# Altium project AGR_SensorHUB.PrjPcb
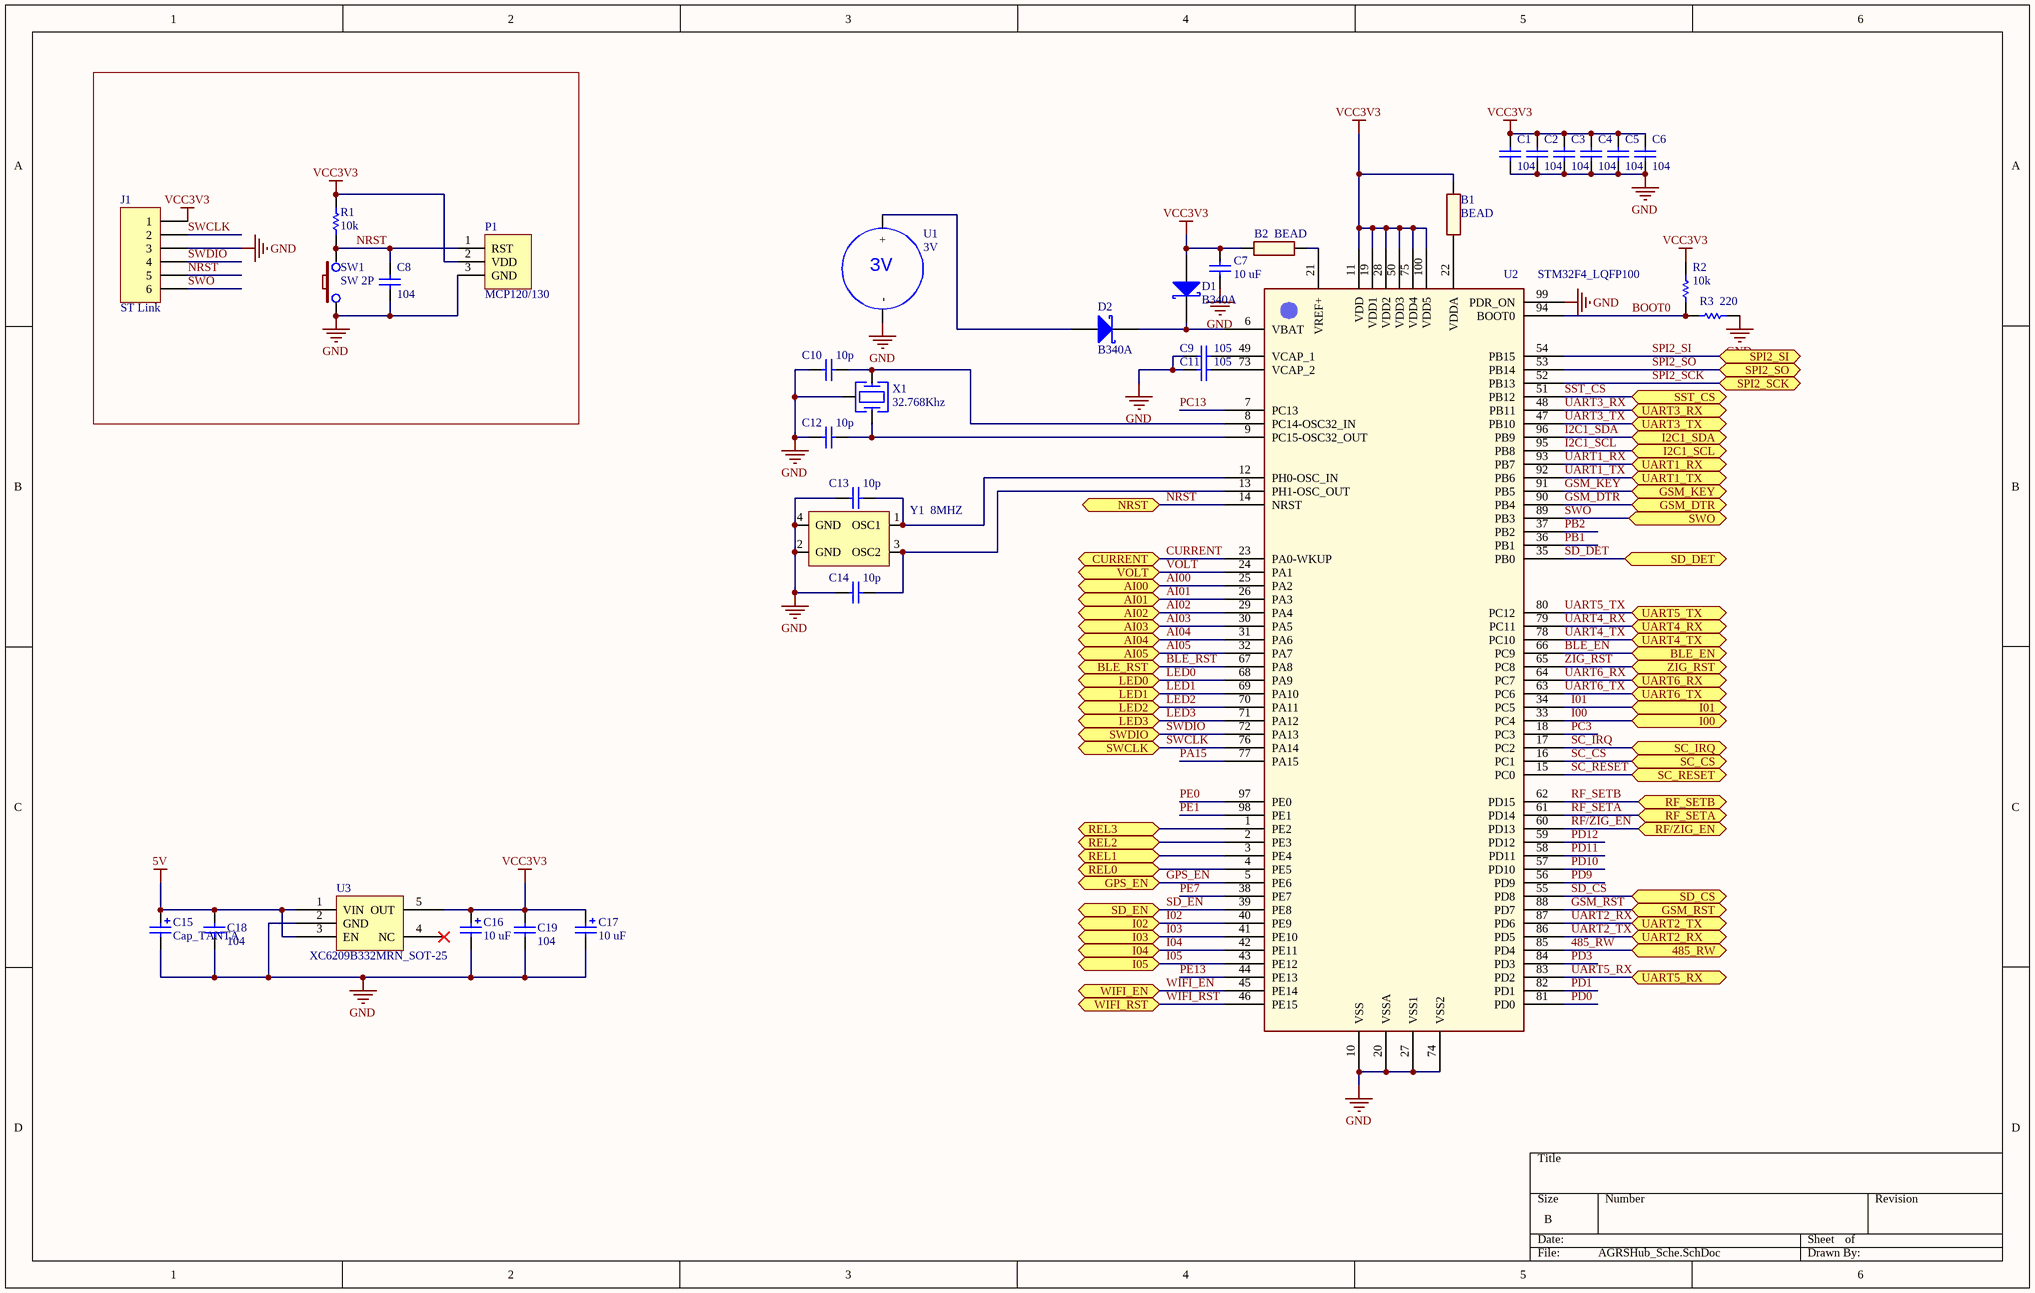
[diagram p0: AGRSHub_Sche.SchDoc]
14 sheets, 159 parts. Net scope: flat (ports and power ports of the same name join across sheets).
Board file: AGRSHUB_PCB.PcbDoc
Sheets:
  AGRSHub_Sche.SchDoc
  GSM.SchDoc
  GPS.SchDoc
  WIFI.SchDoc
  RSxx.SchDoc
  BLE.SchDoc
  DEBUG.SchDoc
  RF.SchDoc
  RELAY.SchDoc
  MEMORY.SchDoc
  INPUT.SchDoc
  DISPLAY.SchDoc
  POWER.SchDoc
  HOLE.SchDoc

## Sheet AGRSHub_Sche.SchDoc
size B

### Parts
B1  BEAD  [0805_M]
B2  BEAD  [0805_M]
C1  104  [C0603]
C2  104  [C0603]
C3  104  [C0603]
C4  104  [C0603]
C5  104  [C0603]
C6  104  [C0603]
C7  10 uF  [C0603]
C8  104  [C0603]
C9  105  [C0603]
C10  10p  [C0603]
C11  105  [C0603]
C12  10p  [C0603]
C13  10p  [C0603]
C14  10p  [C0603]
C15  Cap_TANTA  [CAP_TANTA_SMD_10UF/10V/16V]
C16  10 uF  [CAP_TANTA_SMD_10UF/10V/16V]
C17  10 uF  [CAP_TANTA_SMD_10UF/10V/16V]
C18  104  [C0603]
C19  104  [C0603]
D1  B340A  [DO_213AA]
D2  B340A  [DO_213AA]
J1  ST Link  [HEADER 6]
P1  MCP120/130  [SOT23-3]
R1  10k  [R0603]
R2  10k  [R0603]
R3  220  [R0603]
SW1  SW 2P  [SW TACT]
U1  3V  [BAT CR1220 Holder]
U2  STM32F4_LQFP100  [TSQFP50P1600X1600X160-100N]
U3  XC6209B332MRN_SOT-25  [SOT23-5]
X1  value 32.768Khz  [Crystal cylinder]  (hidden comment: Crystal1)
Y1  8MHZ  [CRYSTAL 5032]

### Ports
485_RW, AI00, AI01, AI02, AI03, AI04, AI05, BLE_EN, BLE_RST, CURRENT, GPS_EN, GSM_DTR, GSM_KEY, GSM_RST, I00, I01, I02, I2C1_SCL, I2C1_SDA, I03, I04, I05, LED0, LED1, LED2, LED3, NRST, REL0, REL1, REL2, REL3, RF/ZIG_EN, RF_SETA, RF_SETB, SC_CS, SC_IRQ, SC_RESET, SD_CS, SD_DET, SD_EN, SPI2_SCK, SPI2_SI, SPI2_SO, SST_CS, SWCLK, SWDIO, SWO, UART1_RX, UART1_TX, UART2_RX, UART2_TX, UART3_RX, UART3_TX, UART4_RX, UART4_TX, UART5_RX, UART5_TX, UART6_RX, UART6_TX, VOLT, WIFI_EN, WIFI_RST, ZIG_RST

### Nets
5V: C15.1 C18.2 U3.1(VIN) U3.3(EN)
GND: C1.1 C2.1 C3.1 C4.1 C5.1 C6.1 C7.1 C8.1 C9.2 C10.2 C11.2 C12.2 C13.1 C14.1 C15.2 C16.2 C17.2 C18.1 C19.1 J1.3 P1.3(GND) R3.2 SW1.1 U1.2(-) U2.10(VSS) U2.20(VSSA) U2.27(VSS1) U2.74(VSS2) U2.99(PDR_ON) U3.2(GND) X1.3(GND) Y1.2(GND) Y1.4(GND)
VCC3V3: B1.1 B2.1 C1.2 C2.2 C3.2 C4.2 C5.2 C6.2 C7.2 C16.1 C17.1 C19.2 D1.1(A) J1.1 P1.2(VDD) R1.2 R2.2 U2.11(VDD) U2.19(VDD1) U2.28(VDD2) U2.50(VDD3) U2.75(VDD4) U2.100(VDD5) U3.5(OUT)
485_RW: U2.85(PD4) ; port 485_RW
AI00: U2.25(PA2) ; port AI00
AI01: U2.26(PA3) ; port AI01
AI02: U2.29(PA4) ; port AI02
AI03: U2.30(PA5) ; port AI03
AI04: U2.31(PA6) ; port AI04
AI05: U2.32(PA7) ; port AI05
BLE_EN: U2.66(PC9) ; port BLE_EN
BLE_RST: U2.67(PA8) ; port BLE_RST
BOOT0: R2.1 R3.1 U2.94(BOOT0)
CURRENT: U2.23(PA0-WKUP) ; port CURRENT
GPS_EN: U2.5(PE6) ; port GPS_EN
GSM_DTR: U2.90(PB4) ; port GSM_DTR
GSM_KEY: U2.91(PB5) ; port GSM_KEY
GSM_RST: U2.88(PD7) ; port GSM_RST
I00: U2.33(PC4) ; port I00
I01: U2.34(PC5) ; port I01
I02: U2.40(PE9) ; port I02
I2C1_SCL: U2.95(PB8) ; port I2C1_SCL
I2C1_SDA: U2.96(PB9) ; port I2C1_SDA
I03: U2.41(PE10) ; port I03
I04: U2.42(PE11) ; port I04
I05: U2.43(PE12) ; port I05
LED0: U2.68(PA9) ; port LED0
LED1: U2.69(PA10) ; port LED1
LED2: U2.70(PA11) ; port LED2
LED3: U2.71(PA12) ; port LED3
NRST: C8.2 J1.5 P1.1(RST) R1.1 SW1.2 U2.14(NRST) ; port NRST
PA15: U2.77(PA15)
PB1: U2.36(PB1)
PB2: U2.37(PB2)
PC3: U2.18(PC3)
PC13: U2.7(PC13)
PD0: U2.81(PD0)
PD1: U2.82(PD1)
PD3: U2.84(PD3)
PD9: U2.56(PD9)
PD10: U2.57(PD10)
PD11: U2.58(PD11)
PD12: U2.59(PD12)
PE0: U2.97(PE0)
PE1: U2.98(PE1)
PE7: U2.38(PE7)
PE13: U2.44(PE13)
REL0: U2.4(PE5) ; port REL0
REL1: U2.3(PE4) ; port REL1
REL2: U2.2(PE3) ; port REL2
REL3: U2.1(PE2) ; port REL3
RF/ZIG_EN: U2.60(PD13) ; port RF/ZIG_EN
RF_SETA: U2.61(PD14) ; port RF_SETA
RF_SETB: U2.62(PD15) ; port RF_SETB
SC_CS: U2.16(PC1) ; port SC_CS
SC_IRQ: U2.17(PC2) ; port SC_IRQ
SC_RESET: U2.15(PC0) ; port SC_RESET
SD_CS: U2.55(PD8) ; port SD_CS
SD_DET: U2.35(PB0) ; port SD_DET
SD_EN: U2.39(PE8) ; port SD_EN
SPI2_SCK: U2.52(PB13) ; port SPI2_SCK
SPI2_SI: U2.54(PB15) ; port SPI2_SI
SPI2_SO: U2.53(PB14) ; port SPI2_SO
SST_CS: U2.51(PB12) ; port SST_CS
SWCLK: J1.2 U2.76(PA14) ; port SWCLK
SWDIO: J1.4 U2.72(PA13) ; port SWDIO
SWO: J1.6 U2.89(PB3) ; port SWO
UART1_RX: U2.93(PB7) ; port UART1_RX
UART1_TX: U2.92(PB6) ; port UART1_TX
UART2_RX: U2.87(PD6) ; port UART2_TX
UART2_TX: U2.86(PD5) ; port UART2_RX
UART3_RX: U2.48(PB11) ; port UART3_RX
UART3_TX: U2.47(PB10) ; port UART3_TX
UART4_RX: U2.79(PC11) ; port UART4_RX
UART4_TX: U2.78(PC10) ; port UART4_TX
UART5_RX: U2.83(PD2) ; port UART5_RX
UART5_TX: U2.80(PC12) ; port UART5_TX
UART6_RX: U2.64(PC7) ; port UART6_RX
UART6_TX: U2.63(PC6) ; port UART6_TX
VOLT: U2.24(PA1) ; port VOLT
WIFI_EN: U2.45(PE14) ; port WIFI_EN
WIFI_RST: U2.46(PE15) ; port WIFI_RST
ZIG_RST: U2.65(PC8) ; port ZIG_RST
NetB1_2: B1.2 U2.22(VDDA)
NetB2_2: B2.2 U2.21(VREF+)
NetC9_1: C9.1 U2.49(VCAP_1)
NetC10_1: C10.1 U2.8(PC14-OSC32_IN) X1.1
NetC11_1: C11.1 U2.73(VCAP_2)
NetC12_1: C12.1 U2.9(PC15-OSC32_OUT) X1.2
NetC13_2: C13.2 U2.12(PH0-OSC_IN) Y1.1(OSC1)
NetC14_2: C14.2 U2.13(PH1-OSC_OUT) Y1.3(OSC2)
NetD1_2: D1.2(K) D2.2(K) U2.6(VBAT)
NetD2_1: D2.1(A) U1.1(+)

Not connected (* = marked no-connect by the designer): U3 4(NC)*

### Library data of the parts
C1-C14 C18 C19 = Cap_SMT: CAP CER 0.1UF 16V Y5V 0402; Manufacturer: Yageo; Manufacturer Part Number: CC0603ZRY5V7BB104; Published: 8-Jun-2000; LatestRevisionDate: 17-Jul-2002; LatestRevisionNote: Re-released for DXP Platform.; PackageReference: C0603; Publisher: Altium Limited; Digi-Key Part Number: 311-1047-1-ND; Unit Price: 0.00648
  C1-C6 C8 C18 C19: Value: 104
  C7: Value: 10 uF
  C9 C11: Value: 105
  C10 C12-C14: Value: 10p
C15-C17 = Cap_TANTA: CAP TANTA
D1 D2 = D Schottky: DIODE SCHOTTKY 40V 3A SMA; Manufacturer Part Number: B340A-E3/61T; Manufacturer: Vishay General Semiconductor; Published: 8-Jun-2000; LatestRevisionDate: 17-Jul-2002; LatestRevisionNote: Re-released for DXP Platform.; PackageReference: DO-214-AA; Publisher: Altium Limited; Code_JEDEC: DO-214-AA; Unit Price: 0.15840; Digi-Key Part Number: B340A-E3/61TGITR-ND
J1 = Header 6
R1-R3 = R_SMD1: Resistor SMD 1%; Manufacturer: Panasonic Electronic Components; Manufacturer Part Number: ERJ-2RKF3241X; Published: 8-Jun-2000; LatestRevisionDate: 17-Jul-2002; LatestRevisionNote: Re-released for DXP Platform.; PackageReference: R0603; Publisher: Altium Limited; Digi-Key Part Number: P3.24KLTR-ND; Unit Price: 0.00203
  R1 R2: Value: 10k
  R3: Value: 220
U1 = Battery Holder
U3 = XC6209B: IC REG LDO 3.3V .3A SOT-25; Digi-Key Part Number: 893-1070-2-ND
X1 = Crystal1: Tuning Forl Crystal Units (SMD-Cylinder Type); Vendor: Digikey; ComponentLink1URL: http://search.digikey.com/scripts/DkSearch/dksus.dll?Detail&name=300-2066-1-ND; ComponentLink1Description: Digikey Part Link; ComponentLink2URL: H:\LIBRARY\LIBRARY.Datasheet\k-cmr.pdf; ComponentLink2Description: Open Datasheet; Publisher: Hoang Nguyen; Published: 13-April-2009
Y1 = CRYSTAL-SMT: NX3225SA-12MHZ-STD-CSR-6; Manufacturer: TXC CORPORATION; Manufacturer Part Number: 7B-8.000MAAJ-T; Value: 8.000 MHZ; Digi-Key Part Number: 644-1180-2-ND; Unit Price: 0.39000

## Sheet GSM.SchDoc
size A
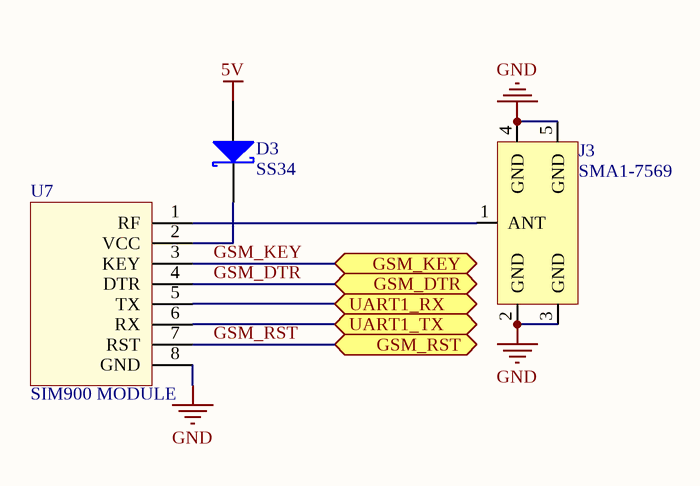
[diagram p1: GSM.SchDoc]

### Parts
D3  SS34  [DO-214AC (SMA)]
J3  SMA1-7569  [ANTENA STAND]
U7  SIM900 MODULE  [SIM900 DEMETER]

### Ports
GSM_DTR, GSM_KEY, GSM_RST, UART1_RX, UART1_TX

### Nets
5V: D3.1(A)
GND: J3.2(GND) J3.3(GND) J3.4(GND) J3.5(GND) U7.8(GND)
GSM_DTR: U7.4(DTR) ; port GSM_DTR
GSM_KEY: U7.3(KEY) ; port GSM_KEY
GSM_RST: U7.7(RST) ; port GSM_RST
UART1_RX: U7.5(TX) ; port UART1_RX
UART1_TX: U7.6(RX) ; port UART1_TX
NetD3_2: D3.2(K) U7.2(VCC)
NetJ3_1: J3.1(ANT) U7.1(RF)

### Library data of the parts
D3 = D Schottky: as D1 on sheet AGRSHub_Sche; Published: 8-Jun-2000; LatestRevisionDate: 17-Jul-2002; LatestRevisionNote: Re-released for DXP Platform.; PackageReference: DO-214-AA; Publisher: Altium Limited; Code_JEDEC: DO-214-AA; Unit Price: 0.15840; Digi-Key Part Number: B340A-E3/61TGITR-ND
J3 = SMA-R/A-F: Unit Price: 0.5; Digi-Key Part Number: NA

## Sheet GPS.SchDoc
size A
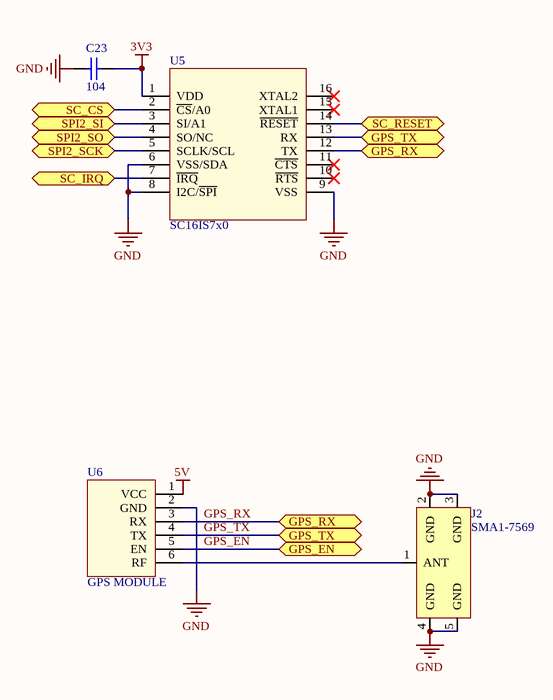
[diagram p2: GPS.SchDoc]

### Parts
C23  104  [C0603]
J2  SMA1-7569  [ANTENA STAND]
U5  SC16IS7x0  [SSOP16_M]
U6  GPS MODULE  [GPS DEMETER]

### Ports
GPS_EN, GPS_RX, GPS_TX, SC_CS, SC_IRQ, SC_RESET, SPI2_SCK, SPI2_SI, SPI2_SO

### Nets
3V3: C23.2 U5.1(VDD)
5V: U6.1(VCC)
GND: C23.1 J2.2(GND) J2.3(GND) J2.4(GND) J2.5(GND) U5.6(VSS/SDA) U5.8(I2C/~{SPI}) U5.9(VSS) U6.2(GND)
GPS_EN: U6.5(EN) ; port GPS_EN
GPS_RX: U5.12(TX) U6.3(RX) ; port GPS_RX
GPS_TX: U5.13(RX) U6.4(TX) ; port GPS_TX
SC_CS: U5.2(~{CS}/A0) ; port SC_CS
SC_IRQ: U5.7(~{IRQ}) ; port SC_IRQ
SC_RESET: U5.14(~{RESET}) ; port SC_RESET
SPI2_SCK: U5.5(SCLK/SCL) ; port SPI2_SCK
SPI2_SI: U5.3(SI/A1) ; port SPI2_SI
SPI2_SO: U5.4(SO/NC) ; port SPI2_SO
NetJ2_1: J2.1(ANT) U6.6(RF)

Not connected (* = marked no-connect by the designer): U5 10(~{RTS})* 11(~{CTS})* 15(XTAL1)* 16(XTAL2)*

### Library data of the parts
C23 = Cap_SMT: as C1 on sheet AGRSHub_Sche; Published: 8-Jun-2000; LatestRevisionDate: 17-Jul-2002; LatestRevisionNote: Re-released for DXP Platform.; PackageReference: C0603; Publisher: Altium Limited; Digi-Key Part Number: 311-1047-1-ND; Unit Price: 0.00648; Value: 104
J2 = SMA-R/A-F: Unit Price: 0.5; Digi-Key Part Number: NA

## Sheet WIFI.SchDoc
size A
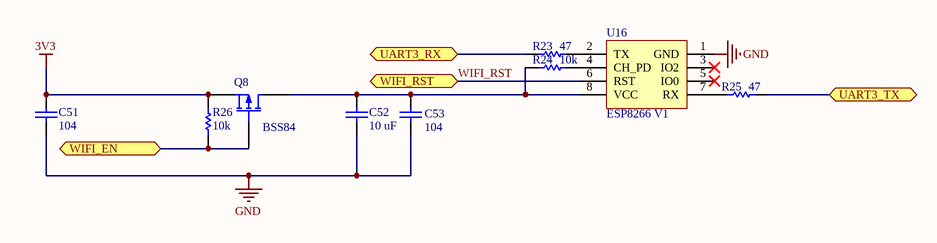
[diagram p3: WIFI.SchDoc]

### Parts
C51  104  [C0603]
C52  10 uF  [C1210]
C53  104  [C0603]
Q8  BSS84  [SOT23-3]
R23  47  [R0603]
R24  10k  [R0603]
R25  47  [R0603]
R26  10k  [R0603]
U16  ESP8266 V1  [ESP8266 MODULE]

### Ports
UART3_RX, UART3_TX, WIFI_EN, WIFI_RST

### Nets
3V3: C51.2 Q8.2(S) R26.1
GND: C51.1 C52.1 C53.1 U16.1(GND)
UART3_RX: R23.1 ; port UART3_RX
UART3_TX: R25.2 ; port UART3_TX
WIFI_EN: Q8.1(G) R26.2 ; port WIFI_EN
WIFI_RST: U16.6(RST) ; port WIFI_RST
NetC52_2: C52.2 C53.2 Q8.3(D) R24.1 U16.8(VCC)
NetR23_2: R23.2 U16.2(TX)
NetR24_2: R24.2 U16.4(CH_PD)
NetR25_1: R25.1 U16.7(RX)

Not connected (* = marked no-connect by the designer): U16 3(IO2)* 5(IO0)*

### Library data of the parts
C51-C53 = Cap_SMT: as C1 on sheet AGRSHub_Sche; Published: 8-Jun-2000; LatestRevisionDate: 17-Jul-2002; LatestRevisionNote: Re-released for DXP Platform.; PackageReference: C0603; Publisher: Altium Limited; Digi-Key Part Number: 311-1047-1-ND; Unit Price: 0.00648
  C51 C53: Value: 104
  C52: Value: 10 uF
Q8 = MOSFET-P GSD: MOSFET P-CH 50V 130MA SOT23-3; Manufacturer: Diodes Inc; Manufacturer Part Number: BSS84-7-F; Published: 8-Jun-2000; LatestRevisionDate: 17-Jul-2002; LatestRevisionNote: Re-released for DXP Platform.; PackageVersion: 1995/1996; PackageReference: E3; Publisher: Altium Limited; Digi-Key Part Number: BSS84-FDITR-ND; Unit Price: 0.06000
R23-R26 = R_SMD5: Resistor SMD 5%; Manufacturer: Panasonic Electronic Components; Manufacturer Part Number: ERJ-2RKF3241X; Published: 8-Jun-2000; LatestRevisionDate: 17-Jul-2002; LatestRevisionNote: Re-released for DXP Platform.; PackageReference: R0603; Publisher: Altium Limited; Digi-Key Part Number: P3.24KLTR-ND; Unit Price: 0.00203
  R23 R25: Value: 47
  R24 R26: Value: 10k
U16 = ESP8266 V1: LatestRevisionDate: 17-Jul-2002; LatestRevisionNote: Re-released for DXP Platform.; Publisher: Altium Limited; Digi-Key Part Number: NA

## Sheet RSxx.SchDoc
size A
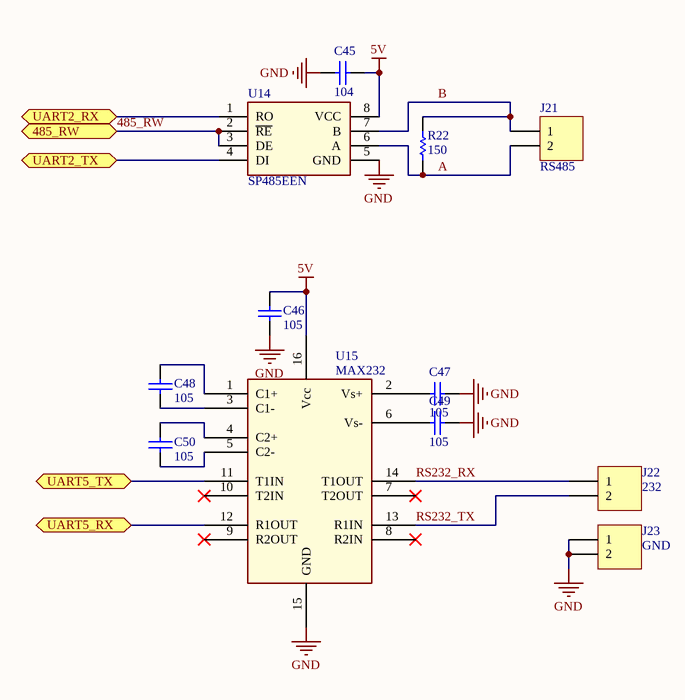
[diagram p4: RSxx.SchDoc]

### Parts
C45  104  [C0603]
C46  105  [C0603]
C47  105  [C0603]
C48  105  [C0603]
C49  105  [C0603]
C50  105  [C0603]
J21  RS485  [DOMINO NORMAL 2]
J22  232  [DOMINO NORMAL 2]
J23  GND  [DOMINO NORMAL 2]
R22  150  [R0603]
U14  SP485EEN  [SO8_L]
U15  MAX232  [SOIC16_M]

### Ports
485_RW, UART2_RX, UART2_TX, UART5_RX, UART5_TX

### Nets
5V: C45.2 C46.2 U14.8(VCC) U15.16(Vcc)
GND: C45.1 C46.1 C47.2 C49.2 J23.1 J23.2 U14.5(GND) U15.15(GND)
485_RW: U14.2(~{RE}) U14.3(DE) ; port 485_RW
A: J21.2 R22.1 U14.6(A)
B: J21.1 R22.2 U14.7(B)
RS232_RX: J22.1 U15.14(T1OUT)
RS232_TX: J22.2 U15.13(R1IN)
UART2_RX: U14.4(DI) ; port UART2_TX
UART2_TX: U14.1(RO) ; port UART2_RX
UART5_RX: U15.12(R1OUT) ; port UART5_RX
UART5_TX: U15.11(T1IN) ; port UART5_TX
NetC47_1: C47.1 U15.2(Vs+)
NetC48_1: C48.1 U15.3(C1-)
NetC48_2: C48.2 U15.1(C1+)
NetC49_1: C49.1 U15.6(Vs-)
NetC50_1: C50.1 U15.5(C2-)
NetC50_2: C50.2 U15.4(C2+)

Not connected (* = marked no-connect by the designer): U15 7(T2OUT)* 8(R2IN)* 9(R2OUT)* 10(T2IN)*

### Library data of the parts
C45-C50 = Cap_SMT: as C1 on sheet AGRSHub_Sche; Published: 8-Jun-2000; LatestRevisionDate: 17-Jul-2002; LatestRevisionNote: Re-released for DXP Platform.; PackageReference: C0603; Publisher: Altium Limited; Digi-Key Part Number: 311-1047-1-ND; Unit Price: 0.00648
  C45: Value: 104
  C46-C50: Value: 105
J21-J23 = Header 2: Header, 2-Pin; LatestRevisionDate: 17-Jul-2002; LatestRevisionNote: Re-released for DXP Platform.; Publisher: Altium Limited
R22 = R_SMD5: as R23 on sheet WIFI; Published: 8-Jun-2000; LatestRevisionDate: 17-Jul-2002; LatestRevisionNote: Re-released for DXP Platform.; PackageReference: R0603; Publisher: Altium Limited; Digi-Key Part Number: P3.24KLTR-ND; Unit Price: 0.00203; Value: 150

## Sheet BLE.SchDoc
size A
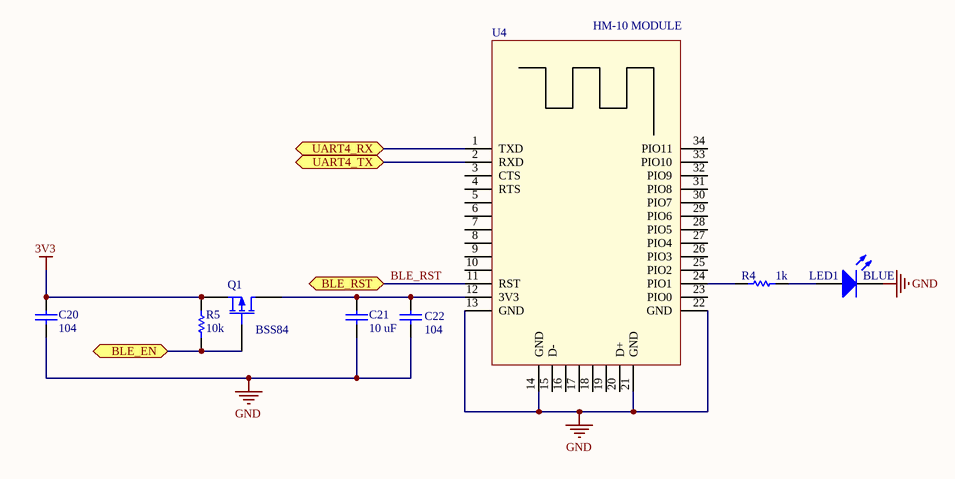
[diagram p5: BLE.SchDoc]

### Parts
C20  104  [C0603]
C21  10 uF  [C1210]
C22  104  [C0603]
LED1  BLUE  [SM/LED_0603]
Q1  BSS84  [SOT23-3]
R4  1k  [R0603]
R5  10k  [R0603]
U4  HM-10 MODULE  [HC-05 BREAKOUT]

### Ports
BLE_EN, BLE_RST, UART4_RX, UART4_TX

### Nets
3V3: C20.2 Q1.2(S) R5.1
GND: C20.1 C21.1 C22.1 LED1.2(K) U4.13(GND) U4.14(GND) U4.21(GND) U4.22(GND)
BLE_EN: Q1.1(G) R5.2 ; port BLE_EN
BLE_RST: U4.11(RST) ; port BLE_RST
UART4_RX: U4.1(TXD) ; port UART4_RX
UART4_TX: U4.2(RXD) ; port UART4_TX
NetC21_2: C21.2 C22.2 Q1.3(D) U4.12(3V3)
NetLED1_1: LED1.1(A) R4.2
NetR4_1: R4.1 U4.24(PIO1)

Not connected (* = marked no-connect by the designer): U4 3(CTS) 4(RTS) 5 6 7 8 9 10 15(D-) 16 17 18 19 20(D+) 23(PIO0) 25(PIO2) 26(PIO3) 27(PIO4) 28(PIO5) 29(PIO6) 30(PIO7) 31(PIO8) 32(PIO9) 33(PIO10) 34(PIO11)

### Library data of the parts
C20-C22 = Cap_SMT: as C1 on sheet AGRSHub_Sche; Published: 8-Jun-2000; LatestRevisionDate: 17-Jul-2002; LatestRevisionNote: Re-released for DXP Platform.; PackageReference: C0603; Publisher: Altium Limited; Digi-Key Part Number: 311-1047-1-ND; Unit Price: 0.00648
  C20 C22: Value: 104
  C21: Value: 10 uF
LED1 = LED: LED GREEN 0.2MM 13MCD 0402 SMD; Manufacturer: Lite-On Inc; Manufacturer Part Number: LTST-C191KGKT; Published: 8-Jun-2000; LatestRevisionDate: 17-Jul-2002; LatestRevisionNote: Re-released for DXP Platform.; PackageVersion: Feb-2002; PackageReference: 3.2X1.6X1.1; Publisher: Altium Limited; Digi-Key Part Number: 511-1592-2-ND; Unit Price: 0.03780; Value: LED GREEN
Q1 = MOSFET-P GSD: as Q8 on sheet WIFI; Published: 8-Jun-2000; LatestRevisionDate: 17-Jul-2002; LatestRevisionNote: Re-released for DXP Platform.; PackageVersion: 1995/1996; PackageReference: E3; Publisher: Altium Limited; Digi-Key Part Number: BSS84-FDITR-ND; Unit Price: 0.06000
R4 = R_SMD1: as R1 on sheet AGRSHub_Sche; Published: 8-Jun-2000; LatestRevisionDate: 17-Jul-2002; LatestRevisionNote: Re-released for DXP Platform.; PackageReference: R0603; Publisher: Altium Limited; Digi-Key Part Number: P3.24KLTR-ND; Unit Price: 0.00203; Value: 1k
R5 = R_SMD5: as R23 on sheet WIFI; Published: 8-Jun-2000; LatestRevisionDate: 17-Jul-2002; LatestRevisionNote: Re-released for DXP Platform.; PackageReference: R0603; Publisher: Altium Limited; Digi-Key Part Number: P3.24KLTR-ND; Unit Price: 0.00203; Value: 10k

## Sheet DEBUG.SchDoc
size B

## Sheet RF.SchDoc
size A
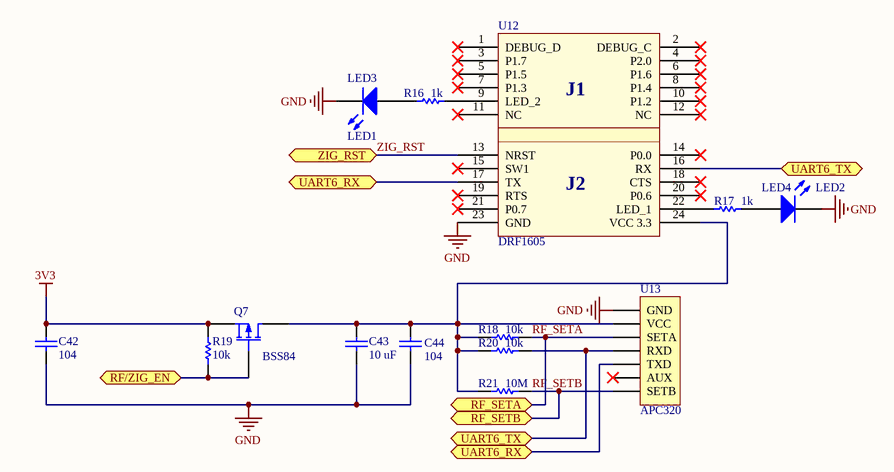
[diagram p6: RF.SchDoc]

### Parts
C42  104  [C0603]
C43  10 uF  [C1210]
C44  104  [C0603]
LED3  LED1  [SM/LED_0603]
LED4  LED2  [SM/LED_0603]
Q7  BSS84  [SOT23-3]
R16  1k  [R0603]
R17  1k  [R0603]
R18  10k  [R0603]
R19  10k  [R0603]
R20  10k  [R0603]
R21  10M  [R0603]
U12  DRF1605  [DRF1605]
U13  APC320  [APC320 - 2D]

### Ports
RF/ZIG_EN, RF_SETA, RF_SETB, UART6_RX, UART6_TX, ZIG_RST

### Nets
3V3: C42.2 Q7.2(S) R19.1
GND: C42.1 C43.1 C44.1 LED3.2(K) LED4.2(K) U12.23(GND) U13.1(GND)
RF/ZIG_EN: Q7.1(G) R19.2 ; port RF/ZIG_EN
RF_SETA: R18.2 U13.3(SETA) ; port RF_SETA
RF_SETB: R21.2 U13.7(SETB) ; port RF_SETB
UART6_RX: U12.17(TX) U13.5(TXD) ; port UART6_RX
UART6_TX: R20.2 U12.16(RX) U13.4(RXD) ; port UART6_TX
ZIG_RST: U12.13(NRST) ; port ZIG_RST
NetC43_2: C43.2 C44.2 Q7.3(D) R18.1 R20.1 R21.1 U12.24(VCC_3.3) U13.2(VCC)
NetLED3_1: LED3.1(A) R16.1
NetLED4_1: LED4.1(A) R17.2
NetR16_2: R16.2 U12.9(LED_2)
NetR17_1: R17.1 U12.22(LED_1)

Not connected (* = marked no-connect by the designer): U12 1(DEBUG_D)* 2(DEBUG_C)* 3(P1.7)* 4(P2.0)* 5(P1.5)* 6(P1.6)* 7(P1.3)* 8(P1.4)* 10(P1.2)* 11(NC)* 12(NC)* 14(P0.0)* 15(SW1)* 18(CTS)* 19(RTS)* 20(P0.6)* 21(P0.7)*; U13 6(AUX)*

### Notes on the sheet
- (in symbol DRF1605) J1; J2

### Library data of the parts
C42-C44 = Cap_SMT: as C1 on sheet AGRSHub_Sche; Published: 8-Jun-2000; LatestRevisionDate: 17-Jul-2002; LatestRevisionNote: Re-released for DXP Platform.; PackageReference: C0603; Publisher: Altium Limited; Digi-Key Part Number: 311-1047-1-ND; Unit Price: 0.00648
  C42 C44: Value: 104
  C43: Value: 10 uF
LED3 LED4 = LED: as LED1 on sheet BLE; Published: 8-Jun-2000; LatestRevisionDate: 17-Jul-2002; LatestRevisionNote: Re-released for DXP Platform.; PackageVersion: Feb-2002; PackageReference: 3.2X1.6X1.1; Publisher: Altium Limited; Digi-Key Part Number: 511-1592-2-ND; Unit Price: 0.03780; Value: LED GREEN
Q7 = MOSFET-P GSD: as Q8 on sheet WIFI; Published: 8-Jun-2000; LatestRevisionDate: 17-Jul-2002; LatestRevisionNote: Re-released for DXP Platform.; PackageVersion: 1995/1996; PackageReference: E3; Publisher: Altium Limited; Digi-Key Part Number: BSS84-FDITR-ND; Unit Price: 0.06000
R16-R21 = R_SMD5: as R23 on sheet WIFI; Published: 8-Jun-2000; LatestRevisionDate: 17-Jul-2002; LatestRevisionNote: Re-released for DXP Platform.; PackageReference: R0603; Publisher: Altium Limited; Digi-Key Part Number: P3.24KLTR-ND; Unit Price: 0.00203
  R16 R17: Value: 1k
  R18-R20: Value: 10k
  R21: Value: 10M

## Sheet RELAY.SchDoc
size A
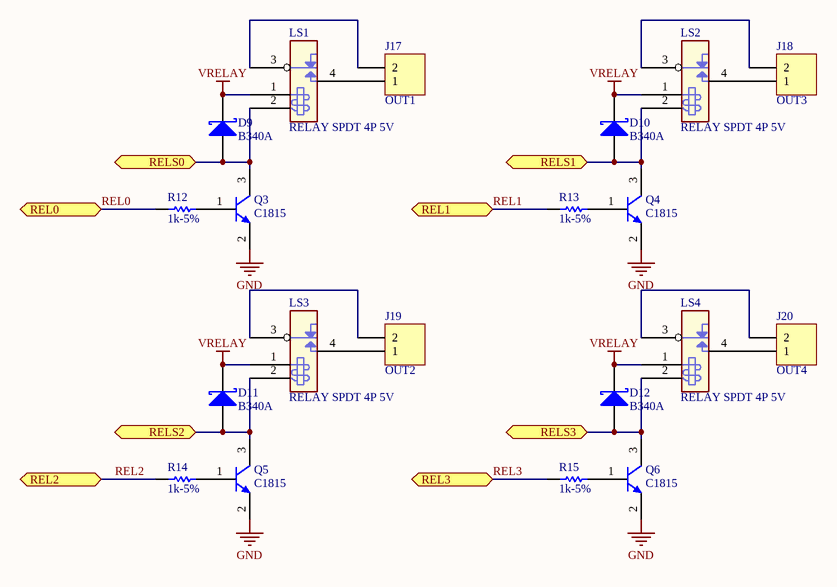
[diagram p7: RELAY.SchDoc]

### Parts
D9  B340A  [DO_213AA]
D10  B340A  [DO_213AA]
D11  B340A  [DO_213AA]
D12  B340A  [DO_213AA]
J17  OUT1  [DOMINO NORMAL 2]
J18  OUT3  [DOMINO NORMAL 2]
J19  OUT2  [DOMINO NORMAL 2]
J20  OUT4  [DOMINO NORMAL 2]
LS1  RELAY SPDT 4P 5V  [RELAY_4PIN_5A_12]
LS2  RELAY SPDT 4P 5V  [RELAY_4PIN_5A_12]
LS3  RELAY SPDT 4P 5V  [RELAY_4PIN_5A_12]
LS4  RELAY SPDT 4P 5V  [RELAY_4PIN_5A_12]
Q3  C1815  [SOT-23B_N]
Q4  C1815  [SOT-23B_N]
Q5  C1815  [SOT-23B_N]
Q6  C1815  [SOT-23B_N]
R12  1k-5%  [R0603]
R13  1k-5%  [R0603]
R14  1k-5%  [R0603]
R15  1k-5%  [R0603]

### Ports
REL0, REL1, REL2, REL3, RELS0, RELS1, RELS2, RELS3

### Nets
GND: Q3.2(E) Q4.2(E) Q5.2(E) Q6.2(E)
VRELAY: D9.2(K) D10.2(K) D11.2(K) D12.2(K) LS1.1(COIL1) LS2.1(COIL1) LS3.1(COIL1) LS4.1(COIL1)
REL0: R12.1 ; port REL0
REL1: R13.1 ; port REL1
REL2: R14.1 ; port REL2
REL3: R15.1 ; port REL3
NetD9_1: D9.1(A) LS1.2(COIL2) Q3.3(C) ; port RELS0
NetD10_1: D10.1(A) LS2.2(COIL2) Q4.3(C) ; port RELS1
NetD11_1: D11.1(A) LS3.2(COIL2) Q5.3(C) ; port RELS2
NetD12_1: D12.1(A) LS4.2(COIL2) Q6.3(C) ; port RELS3
NetJ17_1: J17.1 LS1.4(NO)
NetJ17_2: J17.2 LS1.3(COMMON)
NetJ18_1: J18.1 LS2.4(NO)
NetJ18_2: J18.2 LS2.3(COMMON)
NetJ19_1: J19.1 LS3.4(NO)
NetJ19_2: J19.2 LS3.3(COMMON)
NetJ20_1: J20.1 LS4.4(NO)
NetJ20_2: J20.2 LS4.3(COMMON)
NetQ3_1: Q3.1(B) R12.2
NetQ4_1: Q4.1(B) R13.2
NetQ5_1: Q5.1(B) R14.2
NetQ6_1: Q6.1(B) R15.2

### Library data of the parts
D9-D12 = D Schottky: as D1 on sheet AGRSHub_Sche; Published: 8-Jun-2000; LatestRevisionDate: 17-Jul-2002; LatestRevisionNote: Re-released for DXP Platform.; PackageReference: DO-214-AA; Publisher: Altium Limited; Code_JEDEC: DO-214-AA; Unit Price: 0.15840; Digi-Key Part Number: B340A-E3/61TGITR-ND
J17-J20 = Header 2: Header, 2-Pin; LatestRevisionDate: 17-Jul-2002; LatestRevisionNote: Re-released for DXP Platform.; Publisher: Altium Limited
Q3-Q6 = NPN BEC: TRANSISTOR NPN 50V 150MA; Unit Price: 0.02500; Digi-Key Part Number: NA
R12-R15 = R_SMD5: as R23 on sheet WIFI; Published: 8-Jun-2000; LatestRevisionDate: 17-Jul-2002; LatestRevisionNote: Re-released for DXP Platform.; PackageReference: R0603; Publisher: Altium Limited; Digi-Key Part Number: P3.24KLTR-ND; Unit Price: 0.00203; Value: 1k-5%

## Sheet MEMORY.SchDoc
size A
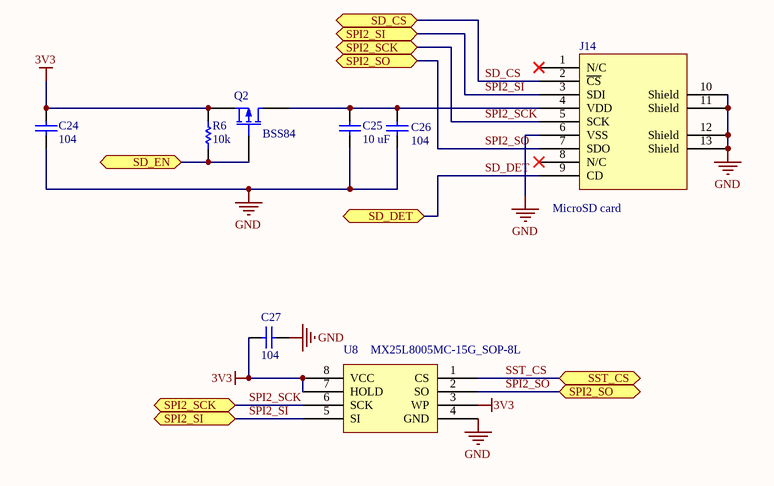
[diagram p8: MEMORY.SchDoc]

### Parts
C24  104  [C0603]
C25  10 uF  [C1210]
C26  104  [C0603]
C27  104  [C0603]
J14  MicroSD card  [MICROSD SOCKET CPSDBT5]
Q2  BSS84  [SOT23-3]
R6  10k  [R0603]
U8  MX25L8005MC-15G_SOP-8L  [FLASH_IC]

### Ports
SD_CS, SD_DET, SD_EN, SPI2_SCK, SPI2_SI, SPI2_SO, SST_CS

### Nets
3V3: C24.2 C27.2 Q2.2(S) R6.1 U8.3(WP) U8.7(HOLD) U8.8(VCC)
GND: C24.1 C25.1 C26.1 C27.1 J14.6(VSS) J14.10(Shield) J14.11(Shield) J14.12(Shield) J14.13(Shield) U8.4(GND)
SD_CS: J14.2(~{CS}) ; port SD_CS
SD_DET: J14.9(CD) ; port SD_DET
SD_EN: Q2.1(G) R6.2 ; port SD_EN
SPI2_SCK: J14.5(SCK) U8.6(SCK) ; port SPI2_SCK
SPI2_SI: J14.3(SDI) U8.5(SI) ; port SPI2_SI
SPI2_SO: J14.7(SDO) U8.2(SO) ; port SPI2_SO
SST_CS: U8.1(CS) ; port SST_CS
NetC25_2: C25.2 C26.2 J14.4(VDD) Q2.3(D)

Not connected (* = marked no-connect by the designer): J14 1(N/C)* 8(N/C)*

### Library data of the parts
C24-C27 = Cap_SMT: as C1 on sheet AGRSHub_Sche; Published: 8-Jun-2000; LatestRevisionDate: 17-Jul-2002; LatestRevisionNote: Re-released for DXP Platform.; PackageReference: C0603; Publisher: Altium Limited; Digi-Key Part Number: 311-1047-1-ND; Unit Price: 0.00648
  C24 C26 C27: Value: 104
  C25: Value: 10 uF
J14 = uSD Push-Push Socket: Digi-Key Part Number: NA
Q2 = MOSFET-P GSD: as Q8 on sheet WIFI; Published: 8-Jun-2000; LatestRevisionDate: 17-Jul-2002; LatestRevisionNote: Re-released for DXP Platform.; PackageVersion: 1995/1996; PackageReference: E3; Publisher: Altium Limited; Digi-Key Part Number: BSS84-FDITR-ND; Unit Price: 0.06000
R6 = R_SMD5: as R23 on sheet WIFI; Published: 8-Jun-2000; LatestRevisionDate: 17-Jul-2002; LatestRevisionNote: Re-released for DXP Platform.; PackageReference: R0603; Publisher: Altium Limited; Digi-Key Part Number: P3.24KLTR-ND; Unit Price: 0.00203; Value: 10k
U8 = MX25L8005MC-15G_SOP-8L: Digi-Key Part Number: 1092-1106-ND

## Sheet INPUT.SchDoc
size A
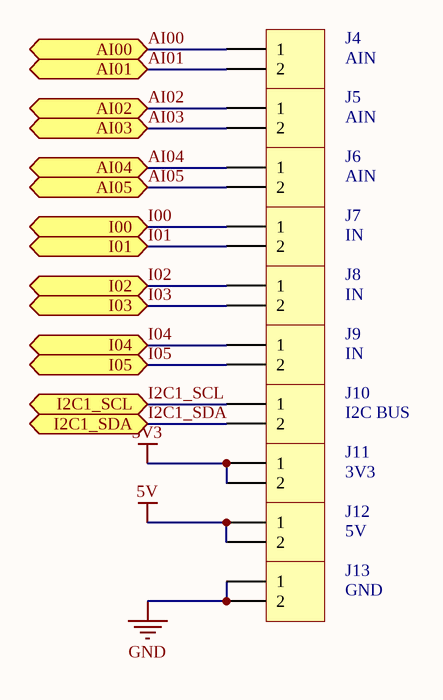
[diagram p9: INPUT.SchDoc]

### Parts
J4  AIN  [DOMINO NORMAL 2]
J5  AIN  [DOMINO NORMAL 2]
J6  AIN  [DOMINO NORMAL 2]
J7  IN  [DOMINO NORMAL 2]
J8  IN  [DOMINO NORMAL 2]
J9  IN  [DOMINO NORMAL 2]
J10  I2C BUS  [DOMINO NORMAL 2]
J11  3V3  [DOMINO NORMAL 2]
J12  5V  [DOMINO NORMAL 2]
J13  GND  [DOMINO NORMAL 2]

### Ports
AI00, AI01, AI02, AI03, AI04, AI05, I00, I01, I02, I2C1_SCL, I2C1_SDA, I03, I04, I05

### Nets
3V3: J11.1 J11.2
5V: J12.1 J12.2
GND: J13.1 J13.2
AI00: J4.1 ; port AI00
AI01: J4.2 ; port AI01
AI02: J5.1 ; port AI02
AI03: J5.2 ; port AI03
AI04: J6.1 ; port AI04
AI05: J6.2 ; port AI05
I00: J7.1 ; port I00
I01: J7.2 ; port I01
I02: J8.1 ; port I02
I2C1_SCL: J10.1 ; port I2C1_SCL
I2C1_SDA: J10.2 ; port I2C1_SDA
I03: J8.2 ; port I03
I04: J9.1 ; port I04
I05: J9.2 ; port I05

### Library data of the parts
J4-J13 = Header 2: Header, 2-Pin; LatestRevisionDate: 17-Jul-2002; LatestRevisionNote: Re-released for DXP Platform.; Publisher: Altium Limited

## Sheet DISPLAY.SchDoc
size A
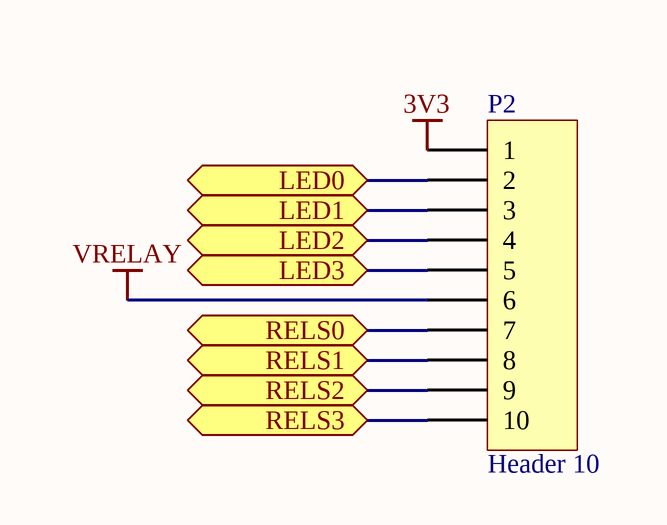
[diagram p10: DISPLAY.SchDoc]

### Parts
P2  Header 10  [BUS_10]

### Ports
LED0, LED1, LED2, LED3, RELS0, RELS1, RELS2, RELS3

### Nets
3V3: P2.1
VRELAY: P2.6
LED0: P2.2 ; port LED0
LED1: P2.3 ; port LED1
LED2: P2.4 ; port LED2
LED3: P2.5 ; port LED3
NetD9_1: P2.7 ; port RELS0
NetD10_1: P2.8 ; port RELS1
NetD11_1: P2.9 ; port RELS2
NetD12_1: P2.10 ; port RELS3

### Library data of the parts
P2 = Header 10: Header, 10-Pin; LatestRevisionDate: 17-Jul-2002; LatestRevisionNote: Re-released for DXP Platform.; Publisher: Altium Limited

## Sheet POWER.SchDoc
size B
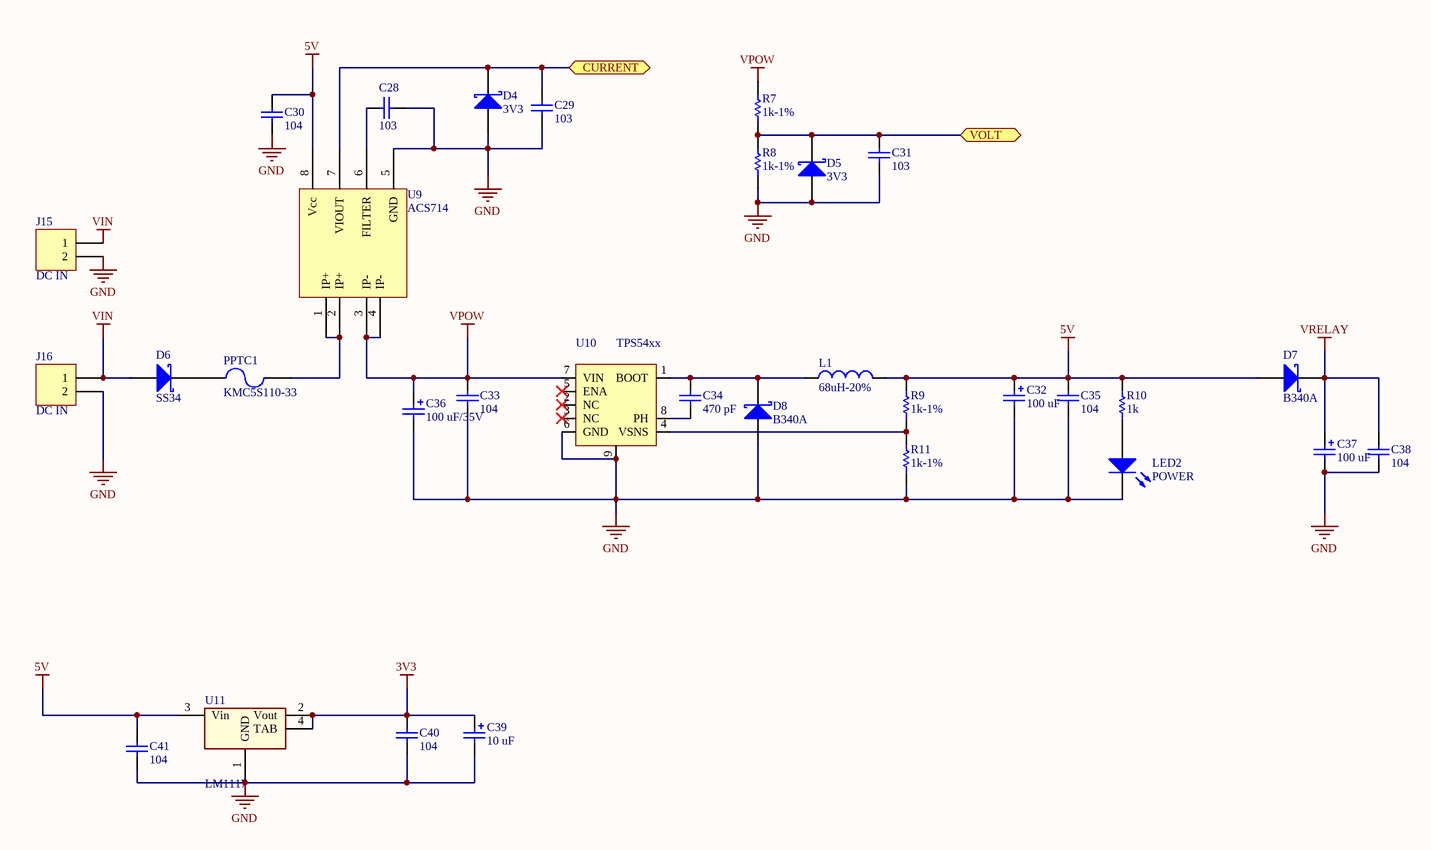
[diagram p11: POWER.SchDoc]

### Parts
C28  103  [C0603]
C29  103  [C0603]
C30  104  [C0603]
C31  103  [C0603]
C32  100 uF  [CAP_TANTA_SMD_100UF/16V]
C33  104  [C0603]
C34  470 pF  [C0603]
C35  104  [C0603]
C36  100 uF/35V  [CAP_AL_SMD (10X10.2)]
C37  100 uF  [CAP_TANTA_SMD_100UF/16V]
C38  104  [C0603]
C39  10 uF  [CAP_TANTA_SMD_100UF/16V]
C40  104  [C0603]
C41  104  [C0603]
D4  3V3  [DO_213AA]
D5  3V3  [DO_213AA]
D6  SS34  [DO-214AC (SMA)]
D7  B340A  [DO-214AC (SMA)]
D8  B340A  [DO-214AC (SMA)]
J15  DC IN  [DOMINO NORMAL 2]
J16  DC IN  [DOMINO NORMAL 2]
L1  68uH-20%  [L10.4W10.4H4.8]
LED2  POWER  [SM/LED_0603]
PPTC1  KMC5S110-33  [PTC1812]
R7  1k-1%  [R0603]
R8  1k-1%  [R0603]
R9  1k-1%  [R0603]
R10  1k  [R0603]
R11  1k-1%  [R0603]
U9  ACS714  [SOIC-8N]
U10  TPS54xx  [HSOIOCN]
U11  LM1117  [SOT223_L]

### Ports
CURRENT, VOLT

### Nets
3V3: C39.1 C40.2 U11.2(Vout) U11.4(TAB)
5V: C30.2 C32.1 C35.2 C41.2 D7.1(A) L1.2 R9.2 R10.2 U9.8(Vcc) U11.3(Vin)
GND: C28.1 C29.1 C30.1 C31.1 C32.2 C33.2 C35.1 C36.2 C37.2 C38.1 C39.2 C40.1 C41.1 D4.1(A) D5.1(A) D8.1(A) J15.2 J16.2 LED2.2(K) R8.1 R11.1 U9.5(GND) U10.6(GND) U10.9(G-PAD) U11.1(GND)
VIN: D6.1(A) J15.1 J16.1
VPOW: C33.1 C36.1 R7.2 U9.3(IP-) U9.4(IP-) U10.7(VIN)
VRELAY: C37.1 C38.2 D7.2(K)
CURRENT: C29.2 D4.2(K) U9.7(VIOUT) ; port CURRENT
VOLT: C31.2 D5.2(K) R7.1 R8.2 ; port VOLT
NetC28_2: C28.2 U9.6(FILTER)
NetC34_1: C34.1 U10.8(PH)
NetC34_2: C34.2 D8.2(K) L1.1 U10.1(BOOT)
NetD6_2: D6.2(K) PPTC1.1
NetLED2_1: LED2.1(A) R10.1
NetPPTC1_2: PPTC1.2 U9.1(IP+) U9.2(IP+)
NetR9_1: R9.1 R11.2 U10.4(VSNS)

Not connected (* = marked no-connect by the designer): U10 2(NC)* 3(NC)* 5(ENA)*

### Library data of the parts
C28-C31 C33-C35 C38 C40 C41 = Cap_SMT: as C1 on sheet AGRSHub_Sche; Published: 8-Jun-2000; LatestRevisionDate: 17-Jul-2002; LatestRevisionNote: Re-released for DXP Platform.; PackageReference: C0603; Publisher: Altium Limited; Digi-Key Part Number: 311-1047-1-ND; Unit Price: 0.00648
  C28 C29 C31: Value: 103
  C30 C33 C35 C38 C40 C41: Value: 104
  C34: Value: 470 pF
C32 C37 C39 = Cap_TANTA: CAP TANTA
C36 = Cap_ALU: CAP ALU
D4-D8 = D Schottky: as D1 on sheet AGRSHub_Sche; Published: 8-Jun-2000; LatestRevisionDate: 17-Jul-2002; LatestRevisionNote: Re-released for DXP Platform.; PackageReference: DO-214-AA; Publisher: Altium Limited; Code_JEDEC: DO-214-AA; Unit Price: 0.15840; Digi-Key Part Number: B340A-E3/61TGITR-ND
J15 J16 = Header 2: Header, 2-Pin; LatestRevisionDate: 17-Jul-2002; LatestRevisionNote: Re-released for DXP Platform.; Publisher: Altium Limited
L1 = Inductor: INDUCTOR POWER 68UH SMD; Manufacturer: Abracon Corporation; Manufacturer Part Number: ASPI-6045S-680M-T; Code_IEC: 1005; Published: 8-Jun-2000; LatestRevisionDate: 29-May-2009; LatestRevisionNote: IPC-7351 Footprint Added.; PackageReference: 0402-A; Publisher: Altium Limited; PackageDescription: Chip Inductor; Code_JEITA: 0402; Digi-Key Part Number: ASPI-6045S-680M-TTR-ND; Unit Price: 0.22500; Value: 68uH-20%
LED2 = LED: as LED1 on sheet BLE; Published: 8-Jun-2000; LatestRevisionDate: 17-Jul-2002; LatestRevisionNote: Re-released for DXP Platform.; PackageVersion: Feb-2002; PackageReference: 3.2X1.6X1.1; Publisher: Altium Limited; Digi-Key Part Number: 511-1592-2-ND; Unit Price: 0.03780; Value: LED GREEN
PPTC1 = Fuse 2: POLYSWITCH .50A RESET FUSE SMD; Manufacturer: TE Connectivity; Manufacturer Part Number: MINISMDC050F-2; Value: MINISMDC050F-2; Published: 8-Jun-2000; LatestRevisionDate: 17-Jul-2002; LatestRevisionNote: Re-released for DXP Platform.; PackageReference: PIN-W2/E2.8; Publisher: Altium Limited; Digi-Key Part Number: MINISMDC050FCT-ND; Unit Price: 0.17304
R7-R9 R11 = R_SMD1: as R1 on sheet AGRSHub_Sche; Published: 8-Jun-2000; LatestRevisionDate: 17-Jul-2002; LatestRevisionNote: Re-released for DXP Platform.; PackageReference: R0603; Publisher: Altium Limited; Digi-Key Part Number: P3.24KLTR-ND; Unit Price: 0.00203; Value: 1k-1%
R10 = R_SMD5: as R23 on sheet WIFI; Published: 8-Jun-2000; LatestRevisionDate: 17-Jul-2002; LatestRevisionNote: Re-released for DXP Platform.; PackageReference: R0603; Publisher: Altium Limited; Digi-Key Part Number: P3.24KLTR-ND; Unit Price: 0.00203; Value: 1k
U9 = ACS714: AutomotiveHall Effect-Based Linear Current Sensor
U10 = TPS54xx: IC REG BUCK ADJ 1A 8SOIC; Manufacturer: Texas Instruments; Manufacturer Part Number: TPS5410DR; Unit Price: 1.6; Digi-Key Part Number: 296-26988-2-ND

## Sheet HOLE.SchDoc
size A
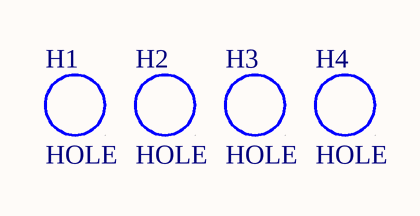
[diagram p12: HOLE.SchDoc]

### Parts
H1  HOLE  [DE_VIT]
H2  HOLE  [DE_VIT]
H3  HOLE  [DE_VIT]
H4  HOLE  [DE_VIT]

### Nets

Not connected (* = marked no-connect by the designer): H1 1; H2 1; H3 1; H4 1

## Nets that join several sheets
3V3: GPS (C23.2 U5.1), WIFI (C51.2 Q8.2 R26.1), BLE (C20.2 Q1.2 R5.1), RF (C42.2 Q7.2 R19.1), MEMORY (7 pins), INPUT (J11.1 J11.2), DISPLAY (P2.1), POWER (C39.1 C40.2 U11.2 U11.4)
5V: AGRSHub_Sche (C15.1 C18.2 U3.1 U3.3), GSM (D3.1), GPS (U6.1), RSxx (C45.2 C46.2 U14.8 U15.16), INPUT (J12.1 J12.2), POWER (10 pins)
GND: AGRSHub_Sche (33 pins), GSM (5 pins), GPS (9 pins), WIFI (C51.1 C52.1 C53.1 U16.1), RSxx (8 pins), BLE (8 pins), RF (7 pins), RELAY (Q3.2 Q4.2 Q5.2 Q6.2), MEMORY (10 pins), INPUT (J13.1 J13.2), POWER (25 pins)
VRELAY: RELAY (8 pins), DISPLAY (P2.6), POWER (C37.1 C38.2 D7.2)
485_RW: AGRSHub_Sche (U2.85), RSxx (U14.2 U14.3)
AI00: AGRSHub_Sche (U2.25), INPUT (J4.1)
AI01: AGRSHub_Sche (U2.26), INPUT (J4.2)
AI02: AGRSHub_Sche (U2.29), INPUT (J5.1)
AI03: AGRSHub_Sche (U2.30), INPUT (J5.2)
AI04: AGRSHub_Sche (U2.31), INPUT (J6.1)
AI05: AGRSHub_Sche (U2.32), INPUT (J6.2)
BLE_EN: AGRSHub_Sche (U2.66), BLE (Q1.1 R5.2)
BLE_RST: AGRSHub_Sche (U2.67), BLE (U4.11)
CURRENT: AGRSHub_Sche (U2.23), POWER (C29.2 D4.2 U9.7)
GPS_EN: AGRSHub_Sche (U2.5), GPS (U6.5)
GSM_DTR: AGRSHub_Sche (U2.90), GSM (U7.4)
GSM_KEY: AGRSHub_Sche (U2.91), GSM (U7.3)
GSM_RST: AGRSHub_Sche (U2.88), GSM (U7.7)
I00: AGRSHub_Sche (U2.33), INPUT (J7.1)
I01: AGRSHub_Sche (U2.34), INPUT (J7.2)
I02: AGRSHub_Sche (U2.40), INPUT (J8.1)
I2C1_SCL: AGRSHub_Sche (U2.95), INPUT (J10.1)
I2C1_SDA: AGRSHub_Sche (U2.96), INPUT (J10.2)
I03: AGRSHub_Sche (U2.41), INPUT (J8.2)
I04: AGRSHub_Sche (U2.42), INPUT (J9.1)
I05: AGRSHub_Sche (U2.43), INPUT (J9.2)
LED0: AGRSHub_Sche (U2.68), DISPLAY (P2.2)
LED1: AGRSHub_Sche (U2.69), DISPLAY (P2.3)
LED2: AGRSHub_Sche (U2.70), DISPLAY (P2.4)
LED3: AGRSHub_Sche (U2.71), DISPLAY (P2.5)
NetD9_1: RELAY (D9.1 LS1.2 Q3.3), DISPLAY (P2.7)
NetD10_1: RELAY (D10.1 LS2.2 Q4.3), DISPLAY (P2.8)
NetD11_1: RELAY (D11.1 LS3.2 Q5.3), DISPLAY (P2.9)
NetD12_1: RELAY (D12.1 LS4.2 Q6.3), DISPLAY (P2.10)
REL0: AGRSHub_Sche (U2.4), RELAY (R12.1)
REL1: AGRSHub_Sche (U2.3), RELAY (R13.1)
REL2: AGRSHub_Sche (U2.2), RELAY (R14.1)
REL3: AGRSHub_Sche (U2.1), RELAY (R15.1)
RF/ZIG_EN: AGRSHub_Sche (U2.60), RF (Q7.1 R19.2)
RF_SETA: AGRSHub_Sche (U2.61), RF (R18.2 U13.3)
RF_SETB: AGRSHub_Sche (U2.62), RF (R21.2 U13.7)
SC_CS: AGRSHub_Sche (U2.16), GPS (U5.2)
SC_IRQ: AGRSHub_Sche (U2.17), GPS (U5.7)
SC_RESET: AGRSHub_Sche (U2.15), GPS (U5.14)
SD_CS: AGRSHub_Sche (U2.55), MEMORY (J14.2)
SD_DET: AGRSHub_Sche (U2.35), MEMORY (J14.9)
SD_EN: AGRSHub_Sche (U2.39), MEMORY (Q2.1 R6.2)
SPI2_SCK: AGRSHub_Sche (U2.52), GPS (U5.5), MEMORY (J14.5 U8.6)
SPI2_SI: AGRSHub_Sche (U2.54), GPS (U5.3), MEMORY (J14.3 U8.5)
SPI2_SO: AGRSHub_Sche (U2.53), GPS (U5.4), MEMORY (J14.7 U8.2)
SST_CS: AGRSHub_Sche (U2.51), MEMORY (U8.1)
UART1_RX: AGRSHub_Sche (U2.93), GSM (U7.5)
UART1_TX: AGRSHub_Sche (U2.92), GSM (U7.6)
UART2_RX: AGRSHub_Sche (U2.87), RSxx (U14.4)
UART2_TX: AGRSHub_Sche (U2.86), RSxx (U14.1)
UART3_RX: AGRSHub_Sche (U2.48), WIFI (R23.1)
UART3_TX: AGRSHub_Sche (U2.47), WIFI (R25.2)
UART4_RX: AGRSHub_Sche (U2.79), BLE (U4.1)
UART4_TX: AGRSHub_Sche (U2.78), BLE (U4.2)
UART5_RX: AGRSHub_Sche (U2.83), RSxx (U15.12)
UART5_TX: AGRSHub_Sche (U2.80), RSxx (U15.11)
UART6_RX: AGRSHub_Sche (U2.64), RF (U12.17 U13.5)
UART6_TX: AGRSHub_Sche (U2.63), RF (R20.2 U12.16 U13.4)
VOLT: AGRSHub_Sche (U2.24), POWER (C31.2 D5.2 R7.1 R8.2)
WIFI_EN: AGRSHub_Sche (U2.45), WIFI (Q8.1 R26.2)
WIFI_RST: AGRSHub_Sche (U2.46), WIFI (U16.6)
ZIG_RST: AGRSHub_Sche (U2.65), RF (U12.13)